# EAGLE design xmas_ornament_2019 (EAGLE 9.5.2)
Assembly variants: Standard
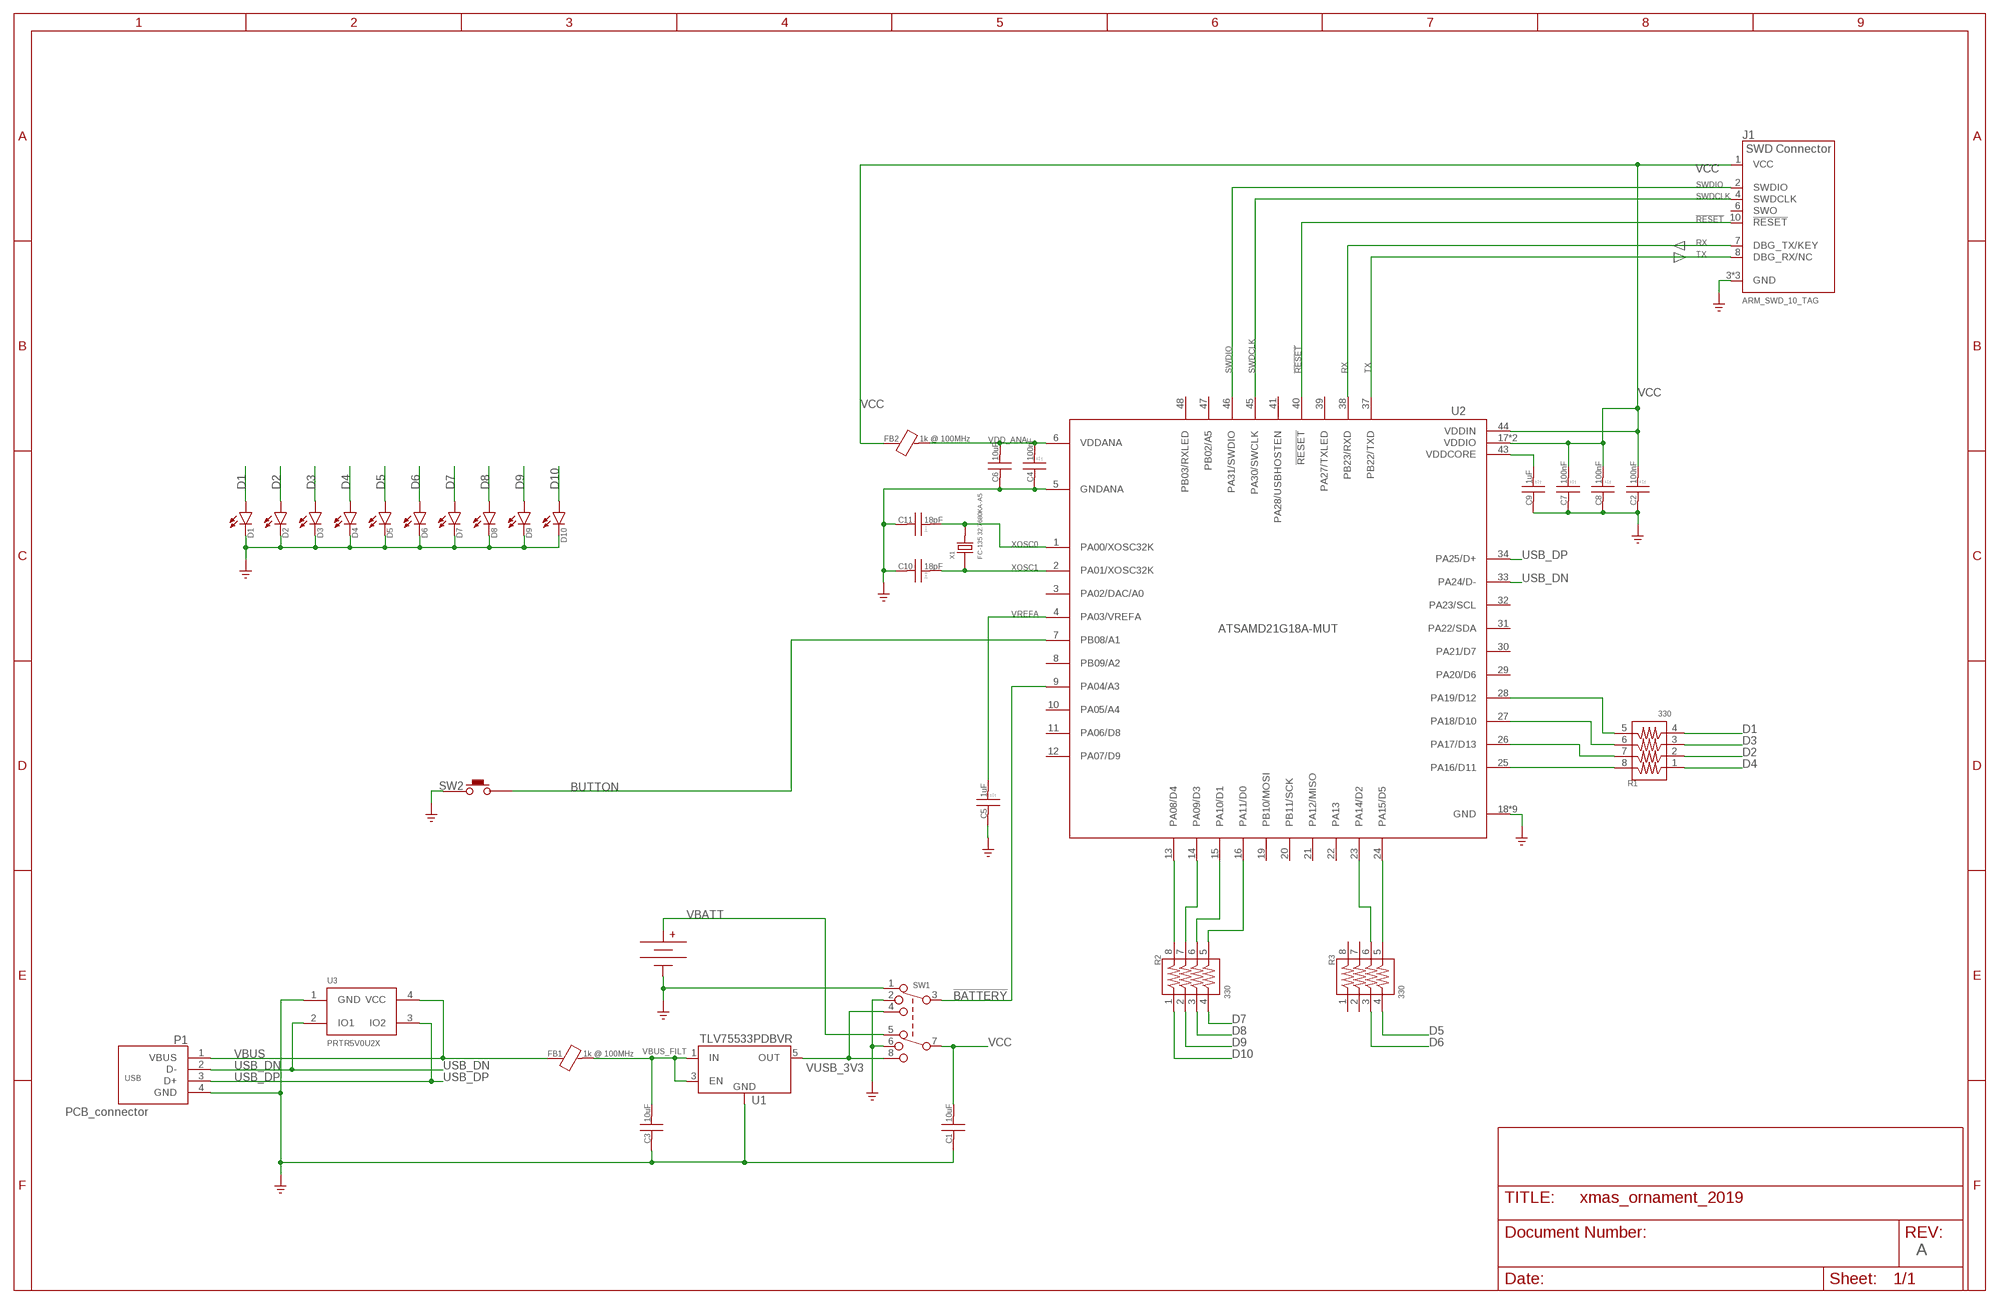
[diagram p0: schematic, sheet 1]

## Parts
C1  10uF  CAP_0805  [0805]
C2  100nF  CAP_0603  [0603]
C3  10uF  CAP_0805  [0805]
C4  100nF  CAP_0603  [0603]
C5  1uF  CAP_0603  [0603]
C6  10uF  CAP_0805  [0805]
C7  100nF  CAP_0603  [0603]
C8  100nF  CAP_0603  [0603]
C9  1uF  CAP_0603  [0603]
C10  18pF  CAP_0603  [0603]
C11  18pF  CAP_0603  [0603]
D1  APT2012LSYCK/J3-PRV  LED0805_BREV  [LED_0805_BREV]
D2  APT2012LSYCK/J3-PRV  LED0805_BREV  [LED_0805_BREV]
D3  APT2012LSYCK/J3-PRV  LED0805_BREV  [LED_0805_BREV]
D4  APT2012LSYCK/J3-PRV  LED0805_BREV  [LED_0805_BREV]
D5  APT2012LSYCK/J3-PRV  LED0805_BREV  [LED_0805_BREV]
D6  APT2012LSYCK/J3-PRV  LED0805_BREV  [LED_0805_BREV]
D7  APT2012LSYCK/J3-PRV  LED0805_BREV  [LED_0805_BREV]
D8  APT2012LSYCK/J3-PRV  LED0805_BREV  [LED_0805_BREV]
D9  APT2012LSYCK/J3-PRV  LED0805_BREV  [LED_0805_BREV]
D10  APT2012LSYCK/J3-PRV  LED0805_BREV  [LED_0805_BREV]
FB1  1k @ 100MHz  FERRITE_BEAD_0603  [0603]
FB2  1k @ 100MHz  FERRITE_BEAD_0603  [0603]
J1  ARM_SWD_10_TAG  [TC2050-IDC-NL]
J2  BU2450-SM-JJ-GTR  BATTERY_BU2450SM-JJ-G  [BU2450SM-JJ-GTR]
P1  PCB_connector  USB-4-PCB-A  [USB-A_PCB]
R1  330  RESISTOR_4_1206  [1206X4]
R2  330  RESISTOR_4_1206  [1206X4]
R3  330  RESISTOR_4_1206  [1206X4]
SW1  JS203011SCQN  SWITCH-DP3T_JS203011SCQN  [JS203011SCQN]
SW2  PTS645SM43SMTR92 LFS  SWITCH-SPST-NO  [SWITCH_6MM]
U1  TLV75533PDBVR  VREG_FIXED+_ENTPS70960DBV  [SOT23-5]
U2  ATSAMD21G18A-MUT  SAMD21G18A-MUT  [QFN-48_GND]
U3  PRTR5V0U2X  [SOT143B]
X1  FC-135 32.7680KA-A5  XTAL-2_3.2X1.5  [XTAL_3.2X1.5]

## Nets
!BATTERY: SW1.3(A_COM) U2.9(PA04/A3)
!RESET: J1.10(!RESET) U2.40(!RESET)
BUTTON: SW2.1 SW2.2 U2.7(PB08/A1)
D1: D1.A R1.4(4A)
D2: D2.A R1.2(2A)
D3: D3.A R1.3(3A)
D4: D4.A R1.1(1A)
D5: D5.A R3.4(4A)
D6: D6.A R3.3(3A)
D7: D7.A R2.4(4A)
D8: D8.A R2.3(3A)
D9: D9.A R2.2(2A)
D10: D10.A R2.1(1A)
GND: C1.1 C2.1 C3.1 C4.1 C5.1 C6.1 C7.1 C8.1 C9.1 C10.1 C11.1 D1.C D2.C D3.C D4.C D5.C D6.C D7.C D8.C D9.C D10.C J1.3(GND) J1.5(GND) J1.9(GND) J2.- P1.4(GND) SW1.1(A1) SW1.2(A2) SW1.6(B2) SW2.3 SW2.4 U1.2(GND) U2.5(GNDANA) U2.18(GND) U2.35(GND) U2.42(GND) U2.GND U2.GND@A1(GND) U2.GND@A2(GND) U2.GND@A3(GND) U2.GND@A4(GND) U2.GND@A(GND) U3.1(GND) ; supply symbol labelled GND_EARTH
N$1: R2.8(1B) U2.13(PA08/D4)
N$2: R2.7(2B) U2.14(PA09/D3)
N$3: R2.6(3B) U2.15(PA10/D1)
N$4: C9.2 U2.43(VDDCORE)
N$5: R2.5(4B) U2.16(PA11/D0)
N$6: R1.8(1B) U2.25(PA16/D11)
N$7: R1.7(2B) U2.26(PA17/D13)
N$8: R1.5(4B) U2.28(PA19/D12)
N$9: R1.6(3B) U2.27(PA18/D10)
N$10: R3.5(4B) U2.24(PA15/D5)
N$11: R3.6(3B) U2.23(PA14/D2)
RX: J1.7(DBG_TX/KEY) U2.38(PB23/RXD)
SWDCLK: J1.4(SWDCLK) U2.45(PA30/SWCLK)
SWDIO: J1.2(SWDIO) U2.46(PA31/SWDIO)
TX: J1.8(DBG_RX/NC) U2.37(PB22/TXD)
USB_DN: P1.2(D-) U2.33(PA24/D-) U3.2(IO1)
USB_DP: P1.3(D+) U2.34(PA25/D+) U3.3(IO2)
VBATT: J2.+ SW1.5(B1)
VBUS: FB1.1 P1.1(VBUS) U3.4(VCC)
VBUS_FILT: C3.2 FB1.2 U1.1(IN) U1.3(EN)
VCC: C1.2 C2.2 C7.2 C8.2 FB2.1 J1.1(VCC) SW1.7(B_COM) U2.17(VDDIO) U2.36(VDDIO) U2.44(VDDIN)
VDD_ANA: C4.2 C6.2 FB2.2 U2.6(VDDANA)
VREFA: C5.2 U2.4(PA03/VREFA)
VUSB_3V3: SW1.4(A3) SW1.8(B3) U1.5(OUT)
XOSC0: C11.2 U2.1(PA00/XOSC32K) X1.2
XOSC1: C10.2 U2.2(PA01/XOSC32K) X1.1
Unconnected: J1.6(SWO) R3.1(1A) R3.2(2A) R3.7(2B) R3.8(1B) U2.3(PA02/DAC/A0) U2.8(PB09/A2) U2.10(PA05/A4) U2.11(PA06/D8) U2.12(PA07/D9) U2.19(PB10/MOSI) U2.20(PB11/SCK) U2.21(PA12/MISO) U2.22(PA13) U2.29(PA20/D6) U2.30(PA21/D7) U2.31(PA22/SDA) U2.32(PA23/SCL) U2.39(PA27/TXLED) U2.41(PA28/USBHOSTEN) U2.47(PB02/A5) U2.48(PB03/RXLED)

## Notes on the sheet
- A

## Library data of the parts
C1 C3 C6 = jetperch:CAP; DIELECTRIC: X7R; MPN: JMK212AB7106KGHT; POPULATE: 1; TOLERANCE: 20%; VOLTAGE: 6.3V
C2 C4 C7 C8 = jetperch:CAP; DIELECTRIC: X5R; MPN: CC0603KRX7R9BB104; POPULATE: 1; TOLERANCE: 20%; VOLTAGE: 50V
C5 C9 = jetperch:CAP; DIELECTRIC: X5R; MPN: CC0603KRX5R6BB105; POPULATE: 1; TOLERANCE: 20%; VOLTAGE: 10V
C10 C11 = jetperch:CAP; DIELECTRIC: C0G; MPN: GRM1885C1H220JA01D; POPULATE: 1; TOLERANCE: 5%; VOLTAGE: 50V
D1-D10 = jetperch:LED: LED Standard single-element LEDs. LED_2SMD_RA suitable for Lite-on LTW-006DCG-E2 LED_2.1x0.6_RA suitable for Kingbright APA2107LZGCK LED_2SMD_REV suitable for Kingbright AM2520ZGCK09 LED_2SMD_REV2 suitable for LP P47F-P2S1-35; MPN: APT2012LSYCK/J3-PRV; POPULATE: 1
FB1 FB2 = jetperch:FERRITE_BEAD; MPN: 742792663; POPULATE: 1
J1 = jetperch:ARM_SWD_10; POPULATE: 0
J2 = jetperch:BATTERY; MPN: BU2450-SM-JJ-GTR; POPULATE: 1
P1 = jetperch:USB-4-PCB: USB 2 Type A 4-pin PCB plug This "connector" uses the PCB without any real connector. WARNING: Although this usually works, it violates the USB specification. It does not correctly attach the shield, and likely will not meet EMI/EMC requirements. Using this connector for high-speed is unwise (just use for full-speed). Real products should not use this!; POPULATE: 0
R1-R3 = jetperch:RESISTOR_4: For panasonic EXB-V8V series resistors; MPN: EXB-38V331JV; POPULATE: 1; TEMP_CO: 200 ppm/°C; TOLERANCE: 5%; WATTAGE: 0.062W
SW1 = jetperch:SWITCH-DP3T; MPN: JS203011SCQN; POPULATE: 1
SW2 = jetperch:SWITCH-SPST-NO; MPN: PTS645SM43SMTR92 LFS; POPULATE: 1
U1 = jetperch:VREG_FIXED+_EN: Positive fixed voltage regulators with enable.; MPN: TLV75533PDBVR; POPULATE: 1
U2 = jetperch:SAMD21G18A-MUT; POPULATE: 1
U3 = jetperch:PRTR5V0U2X: Nexperia (NXP) PRTR5V0U2X TVS suitable for high-speed USB protection.; MPN: PRTR5V0U2X,215; POPULATE: 1
X1 = jetperch:XTAL-2; POPULATE: 1

## Board
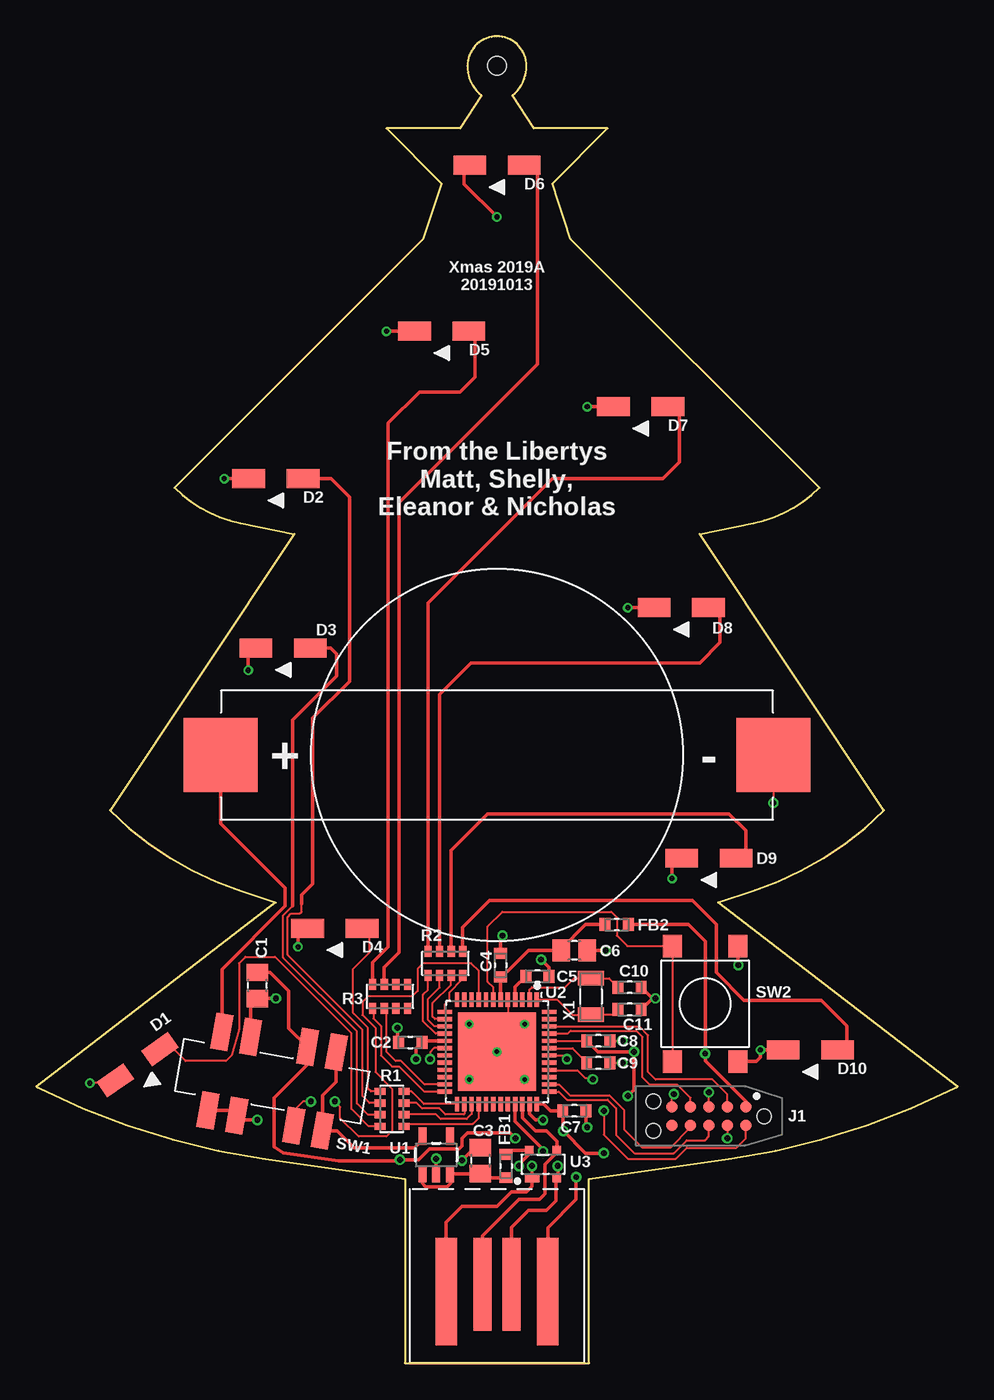
[diagram p1: board, top side]
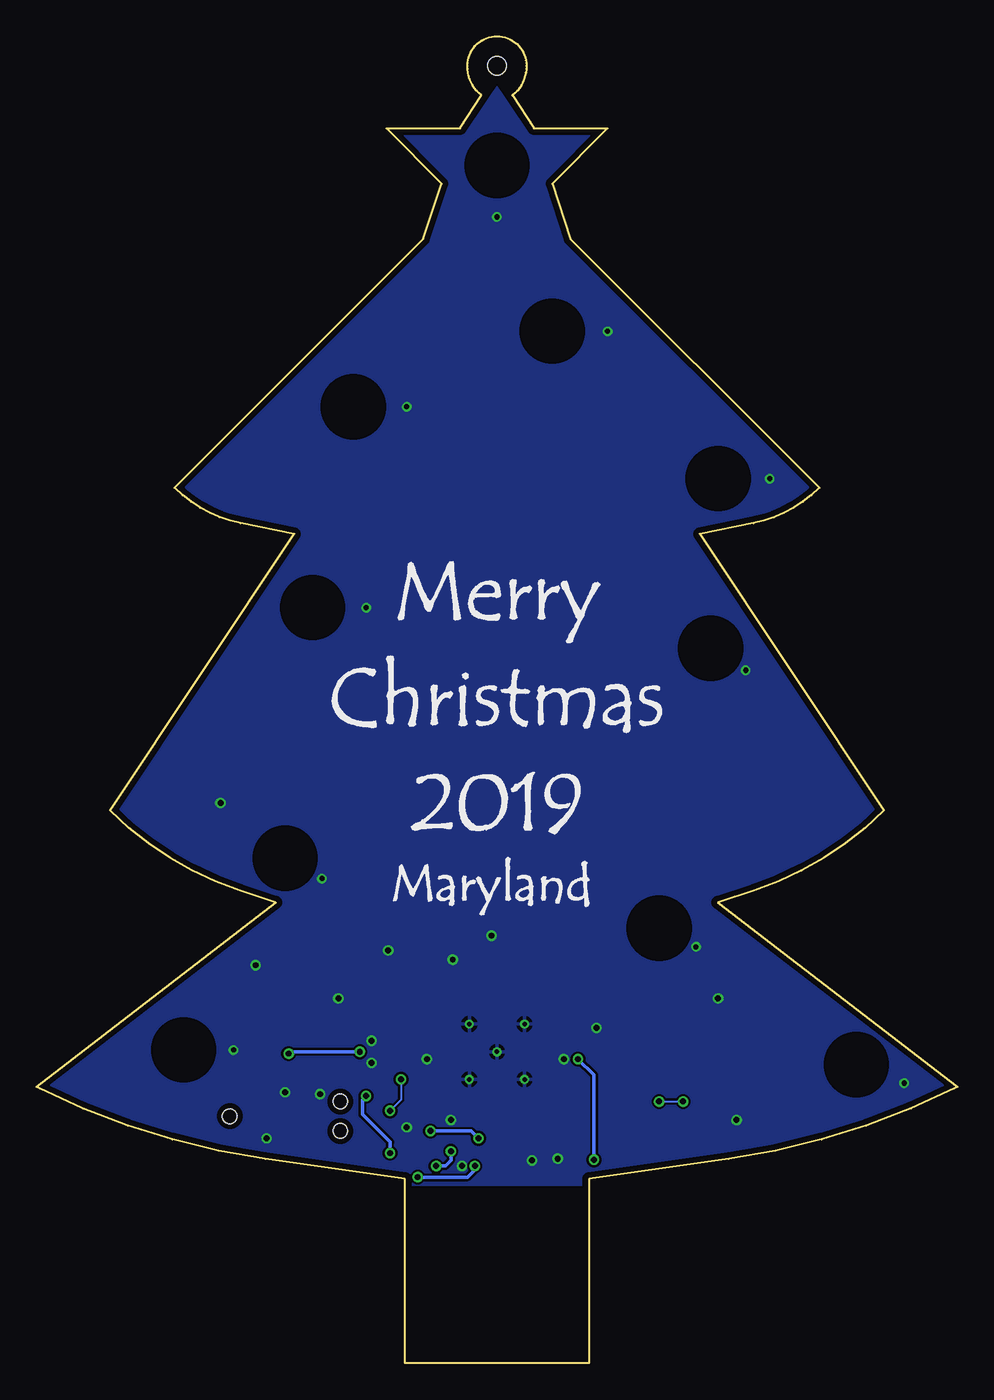
[diagram p2: board, bottom side, seen from below]

Size 63.5 x 91.44 mm. Coordinates in mm from the lower left corner, seen from the top.
Outline: 0,19.05 0.25,18.93 arc18 15.78,14.07 25.4,12.7 25.4,0 38.1,0 38.1,12.7 47.72,14.07 arc18 63.25,18.93 63.5,19.05 46.99,31.75 49.5,32.59 arc27 58.42,38.1 45.72,57.15 49.43,57.89 arc34 53.98,60.33 36.83,77.47 35.56,81.28 39.37,85.09 34.29,85.09 32.82,87.38 arc53 33.78,89.41 arc90 31.75,91.44 arc90 29.72,89.41 arc53 30.68,87.38 29.21,85.09 24.13,85.09 27.94,81.28 26.67,77.47 9.53,60.33 arc34 14.07,57.89 17.78,57.15 5.08,38.1 arc27 14,32.59 16.51,31.75 0,19.05
Copper layers (1*16): Top 0.035mm / dielectric 62mil / Bottom 0.035mm
Design rules "jetperch_2layer_oshpark *": minimum track width 6mil, minimum drill 12mil, track to track 6mil, track to pad 6mil, pad to pad 6mil, via to via 6mil, smd to smd 0mil, copper to edge 15mil, drill to drill 15mil, minimum pad ring 6mil, minimum via ring 6mil, stop-mask expansion 2mil, vias tented up to drill 17mil, thermal gap 10mil
Holes 1.27 mm at 31.75,89.41
bRestrict: area 29.2,85.1 to 34.3,89.7; area 25.4,0 to 38.1,12.2

### Footprints (pad centres in the part's own frame; a part is rotated, then mirrored left to right if it is on the bottom)
0805 = smd 1.198 x 1.5: 1 -0.899,0; 2 0.899,0
0603 = smd 0.75 x 0.9: 1 -0.8,0; 2 0.8,0
LED_0805_BREV = smd 2.25 x 1.3: A 1.875,0; C -1.875,0
TC2050-IDC-NL = smd 0.787 x 0.787: 1 -2.54,-0.635; 2 -1.27,-0.635; 3 0,-0.635; 4 1.27,-0.635; 5 2.54,-0.635; 6 2.54,0.635; 7 1.27,0.635; 8 0,0.635; 9 -1.27,0.635; 10 -2.54,0.635 | hole 0.991: -3.81,0; 3.81,1.016; 3.81,-1.016
BU2450SM-JJ-GTR = smd 5.08 x 5.08: + 19.05,0; - -19.05,0
USB-A_PCB = smd 1.5 x 7.41: 1 -3.5,1.055; 4 3.5,1.055 | smd 1.25 x 6.41: 2 -1,0.555; 3 1,0.555
1206X4 = smd 0.5 x 0.75: 1 -1.2,-0.825; 2 -0.4,-0.825; 3 0.4,-0.825; 4 1.2,-0.825; 5 1.2,0.825; 6 0.4,0.825; 7 -0.4,0.825; 8 -1.2,0.825
JS203011SCQN = smd 1.194 x 2.502: 1 -4,-2.75; 2 -1.994,-2.75; 3 1.994,-2.75; 4 4,-2.75; 5 -4,2.75; 6 -1.994,2.75; 7 1.994,2.75; 8 4,2.75
SWITCH_6MM = smd 1.55 x 1.3: 1 -3.975,2.25; 2 3.975,2.25; 3 -3.975,-2.25; 4 3.975,-2.25
SOT23-5 = smd 0.55 x 1.2: 1 -0.95,-1.3; 2 0,-1.3; 3 0.95,-1.3; 4 0.95,1.3; 5 -0.95,1.3
QFN-48_GND = smd 1 x 0.3: 1 -3.6,2.75; 2 -3.6,2.25; 3 -3.6,1.75; 4 -3.6,1.25; 5 -3.6,0.75; 6 -3.6,0.25; 7 -3.6,-0.25; 8 -3.6,-0.75; 9 -3.6,-1.25; 10 -3.6,-1.75; 11 -3.6,-2.25; 12 -3.6,-2.75; 25 3.6,-2.75; 26 3.6,-2.25; 27 3.6,-1.75; 28 3.6,-1.25; 29 3.6,-0.75; 30 3.6,-0.25; 31 3.6,0.25; 32 3.6,0.75; 33 3.6,1.25; 34 3.6,1.75; 35 3.6,2.25; 36 3.6,2.75 | smd 0.3 x 1: 13 -2.75,-3.6; 14 -2.25,-3.6; 15 -1.75,-3.6; 16 -1.25,-3.6; 17 -0.75,-3.6; 18 -0.25,-3.6; 19 0.25,-3.6; 20 0.75,-3.6; 21 1.25,-3.6; 22 1.75,-3.6; 23 2.25,-3.6; 24 2.75,-3.6; 37 2.75,3.6; 38 2.25,3.6; 39 1.75,3.6; 40 1.25,3.6; 41 0.75,3.6; 42 0.25,3.6; 43 -0.25,3.6; 44 -0.75,3.6; 45 -1.25,3.6; 46 -1.75,3.6; 47 -2.25,3.6; 48 -2.75,3.6 | smd 5.4 x 5.4: GND 0,0 | drill 0.305: GND@A 0,0; GND@A1 -1.905,1.905; GND@A2 1.905,1.905; GND@A3 1.905,-1.905; GND@A4 -1.905,-1.905
SOT143B = smd 1 x 0.6: 1 -0.75,-0.95 | smd 0.6 x 0.6: 2 0.95,-0.95; 3 0.95,0.95; 4 -0.95,0.95
XTAL_3.2X1.5 = smd 1 x 1.8: 1 -1.25,0; 2 1.25,0

### Placement (x,y rotation side)
C1  15.24,26.04 90 top
C2  25.78,22.1 0 top
C3  30.61,13.97 270 top
C4  32,27.43 270 top
C5  34.54,26.67 180 top
C6  37.08,28.45 180 top
C7  37.08,17.4 180 top
C8  38.73,22.23 180 top
C9  38.73,20.7 180 top
C10  40.89,25.91 180 top
C11  40.89,24.38 180 top
D1  6.99,20.57 35 top
D2  16.51,60.96 0 top
D3  17.02,49.28 0 top
D4  20.57,29.97 0 top
D5  27.94,71.12 0 top
D6  31.75,82.55 0 top
D7  41.66,65.91 0 top
D8  44.45,52.07 0 top
D9  46.35,34.8 0 top
D10  53.34,21.59 0 top
FB1  32.38,13.59 270 top
FB2  40.01,30.23 180 top
J1  46.35,17.02 180 top
J2  31.75,41.91 180 top
P1  31.75,6 180 top
R1  24.51,17.53 270 top
R2  28.19,27.56 180 top
R3  24.38,25.27 180 top
SW1  16.26,19.43 350 top
SW2  46.1,24.77 90 top
U1  27.56,14.35 0 top
U2  31.75,21.46 270 top
U3  34.92,13.72 0 top
X1  38.23,25.27 270 top

### Tracks (layer width: path | path; a pad name or v marks a point on that pad's centre or on a via)
!BATTERY  (via drill 0.41)
  Top 0.152: U2.9 30.5,27.03 29.97,27.56 26.67,27.56 26.29,27.18 26.29,25.65 25.91,25.27 22.86,25.27 22.48,24.89 22.48,24 23.37,23.11 23.37,20.07 24.51,18.92 24.51,16 24.13,15.62 22.23,15.62 20.95,16.89 20.95,17.65 v20.57,18.03 | SW1.3 17.74,17.39 18.38,18.03 v18.92,18.03
  Bottom 0.152: v20.57,18.03 v18.92,18.03
!RESET  (via drill 0.41)
  Top 0.152: U2.40 35.37,20.19 37.3,20.19 37.84,19.64 38.27,19.64 v38.35,19.56 | v39.12,17.4 39.12,15.75 40.77,14.1 44.07,14.1 44.83,14.86 48.26,14.86 48.9,15.49 J1.10
  Bottom 0.152: v39.12,17.4 38.35,18.16 v38.35,19.56
BUTTON
  Top 0.152: U2.7 31.5,25.9 31.11,26.29 31.11,30.1 32.13,31.11 39.62,31.11 40.01,30.73 40.01,29.46 40.73,28.74 SW2.2 SW2.1
D1
  Top 0.152: R1.4 22.92,16.33 21.72,17.53 21.72,22.73 16.45,28 14.41,28 13.97,27.56 13.97,23 13.46,21.21 13.08,20.83 10.29,20.83 9.4,21.72 8.59,21.72 D1.A
D2
  Top 0.152: R1.2 22.97,17.93 22.48,18.41 22.48,22.99 17.32,28.14 17.32,30.73 17.58,30.99 18.16,30.99 18.29,31.11 18.29,31.66
  Top 0.254: D2.A 20.32,60.96 21.59,59.69 21.59,46.99 19.05,44.45 19.05,33.02 18.29,32.26 18.29,31.66
D3
  Top 0.152: R1.3 22.88,17.13 22.1,17.91 22.1,22.86 17.02,27.94 17.02,30.86 17.65,31.5
  Top 0.254: 17.65,31.5 17.65,44.32 20.7,47.37 20.7,48.87 20.29,49.28 D3.A
D4
  Top 0.152: R1.1 23.06,18.73 22.86,18.92 22.86,23.11 21.84,24.13 21.84,27.18 22.99,28.32 22.99,29.43 D4.A
D5
  Top 0.254: R3.4 23.18,27.63 24.26,28.7 24.26,64.77 26.42,66.93 29.21,66.93 30.23,67.94 30.23,70.71 D5.A
D6
  Top 0.254: R3.3 23.98,27.29 25.02,28.32 25.02,59.31 34.54,68.83 34.54,82.14 34.13,82.55 D6.A
D7
  Top 0.254: R2.4 26.99,52.39 35.56,60.96 43.18,60.96 44.32,62.1 44.32,65.41 43.81,65.91 D7.A
D8
  Top 0.254: R2.3 27.79,46.08 29.97,48.26 45.72,48.26 47.12,49.66 47.12,51.82 46.86,52.07 D8.A
D9
  Top 0.254: R2.2 28.59,35.33 31.11,37.85 47.75,37.85 48.9,36.7 48.9,35.31 48.39,34.8 D9.A
D10
  Top 0.254: D10.A 55.47,21.84 55.88,21.84 55.88,23.24 54.1,25.02 48.77,25.02 46.86,26.92 46.86,30.23 45.21,31.88 31.24,31.88 29.39,30.03 R2.1
GND  (via drill 0.35, 0.41)
  Top 0.152: J1.3 v46.35,18.67 | J1.9 v47.62,15.49 | J1.5 43.81,18.41 v43.94,18.54 | C8.1 v40.39,22.23 | C9.1 v40.39,20.7 | U2.42 36.32,21.21 v36.58,20.95 | J2.- v50.8,38.61 | U2.5 32.5,22.21 U2.GND@A | U2.18 27.43,21.72 27.14,21.43 v27.14,20.95 | D1.C 5.25,19.3 v3.68,19.3
  Top 0.254: P1.4 28.25,9.71 29.34,10.79 31.75,10.79 32.77,11.81 33.78,11.81 34.17,12.2 U3.1 34.17,13.58 v34.16,13.59 | U1.2 v27.56,14.1 | C3.1 30.24,14.87 v29.34,13.97 | U2.35 34,17.18 34.42,16.76 v34.92,16.76 | C11.1 42.46,25.15 | C10.1 42.46,25.15 | 42.46,25.15 v42.67,25.15 | C6.1 v39.24,28.45 | C5.1 35.34,27.27 v34.8,27.81 | v32.13,29.46 32,29.34 C4.1 | v16.51,25.15 16.5,25.14 C1.1 14.77,24.67 SW1.6 | C2.1 24.89,22.19 v24.89,23.11 | SW1.1 13.47,17.42 SW1.2 14.12,16.76 v15.24,16.76 | SW2.4 48.35,27.47 v48.39,27.43 | SW2.3 49.62,20.79 49.91,21.08 v49.91,21.59 D10.C | C7.1 37.88,16.34 v37.97,16.26 | D4.C 18.32,29.97 18.03,29.69 v18.03,28.7 | D3.C 14.61,48.74 v14.61,47.75 | D2.C v12.95,60.96 | D5.C v24.13,71.12 | D6.C 29.49,82.17 29.49,81.25 v31.75,78.99 | D7.C v37.97,65.91 | D8.C v40.77,52.07 | D9.C 44.23,34.8 43.81,34.39 v43.81,33.4
  pour Bottom: 0,0 0,88.9 63.5,88.9 63.5,0
N$1
  Top 0.152: R2.8 29.39,26.47 28.45,25.53 28.45,25.02 28.15,24.72 U2.13
N$2
  Top 0.152: R2.7 28.57,26.71 28.57,26.09 27.3,24.82 27.3,23.88 27.47,23.71 U2.14
N$3
  Top 0.152: U2.15 27.46,23.21 27,23.67 27,25.09 27.79,25.89 R2.6
N$4
  Top 0.152: U2.43 36.96,21.71 37.94,20.74 C9.2
N$5
  Top 0.152: U2.16 27.53,22.71 26.67,23.57 26.67,25.4 26.99,25.72 R2.5
N$6
  Top 0.152: U2.25 26.71,17.86 25.85,18.73 R1.8
N$7
  Top 0.152: U2.26 29.5,17.18 29.45,17.13 28.2,17.13 27.78,17.56 26.59,17.56 26.22,17.93 R1.7
N$8
  Top 0.152: R1.5 25.52,16.51 30.1,16.51 30.5,16.91 U2.28
N$9
  Top 0.152: U2.27 30,17.17 29.66,16.83 27.87,16.83 27.56,17.14 25.36,17.14 R1.6
N$10
  Top 0.152: U2.24 26.75,18.71 25.02,20.45 24.51,20.45 23.75,21.21 23.75,23.24 23.24,23.75 23.24,24.39 R3.5
N$11
  Top 0.152: U2.23 26.76,19.21 25.15,20.83 24.77,20.83 24.11,21.48 24.11,24.32 R3.6
RX
  Top 0.152: J1.7 45.09,16.26 43.69,14.86 41.78,14.86 40.51,16.13 40.51,17.45 39.5,18.47 36.78,18.47 36.03,19.21 U2.38
SWDCLK
  Top 0.152: U2.45 36.64,22.71 36.83,22.9 41.36,22.9 41.78,22.48 41.78,19.68 42.29,19.18 44.2,19.18 45.09,18.29 J1.4
SWDIO
  Top 0.152: U2.46 41.56,23.21 42.16,22.61 42.16,20.07 42.67,19.56 46.61,19.56 47.62,18.54 J1.2
TX
  Top 0.152: J1.8 46.35,15.62 46.1,15.37 44.83,15.37 43.94,14.48 41.23,14.48 39.95,15.75 39.95,17.58 39.37,18.16 36.58,18.16 36.02,18.71 U2.37
USB_DN  (via drill 0.41)
  Top 0.254: P1.2 32.75,9.38 33.91,10.54 35.18,10.54 35.81,11.18 35.81,12.71 U3.2 35.94,12.83 v35.94,13.59 | U2.33 33,16.66 34.92,14.73 v34.92,14.61
  Bottom 0.254: v34.92,14.61 34.92,13.97 35.31,13.59 v35.94,13.59
USB_DP
  Top 0.254: P1.3 30.75,8.78 33.27,11.3 34.67,11.3 35.05,11.68 35.05,13.72 35.88,14.54 U3.3 35.88,15.31 35.18,16 34.42,16 33.5,16.92 U2.34
VBATT
  Top 0.254: J2.+ 12.7,37.21 17.14,32.77 17.14,31.5 12.79,27.14 SW1.5
VBUS  (via drill 0.41)
  Top 0.254: FB1.1 32.42,14.35 32.51,14.35 32.83,14.67 U3.4 33.91,14.6 33.91,14.35 33.27,13.72 v33.27,13.59 | P1.1 35.25,9.34 37.21,11.3 v37.21,12.83
  Bottom 0.254: v37.21,12.83 33.78,12.83 33.27,13.34 v33.27,13.59
VBUS_FILT
  Top 0.254: FB1.2 30.89,12.79 C3.2 30.59,13.05 28.57,13.05 | U1.3 28.57,13.05 | U1.1 26.61,12.38 26.82,12.17 28.3,12.17 28.57,12.45 28.57,13.05
VCC  (via drill 0.41)
  Top 0.152: U2.44 37.92,22.21 C8.2
  Top 0.254: U2.17 26.7,22.21 C2.2 26.16,21.68 v26.16,20.95 | U2.36 34.97,17.86 35.43,17.4 C7.2 36.28,16.04 v36.32,16 37.85,14.48 v39.12,14.48 | C1.2 16.12,26.93 17.4,25.65 17.4,23.09 SW1.7 18.7,20.6 16.38,18.29 16.38,14.9 17,14.49 20.85,13.94 24.98,13.94 v25.06,14.02 26.34,14.02 27.09,14.77 29.12,14.77 29.34,14.99 29.34,15.49 29.72,15.88 32.64,15.88 v33.02,15.49 | FB2.1 44.96,30.23 46.1,29.08 v46.1,21.34 46.1,20.83 48.9,18.03 J1.1 | C8.2 38.7,21.46 v41.2,21.46 41.2,18.85 v40.77,18.41
  Bottom 0.254: v41.2,21.46 45.97,21.46 v46.1,21.34 | v25.06,14.02 25.06,19.86 v26.16,20.95 | v39.12,14.48 39.12,15.24 41.02,17.14 41.02,18.16 v40.77,18.41 | v33.02,15.49 33.53,16 v36.32,16
VDD_ANA
  Top 0.254: U2.6 C4.2 32.09,26.63 33.91,28.45 C6.2 36.19,28.57 37.85,30.23 FB2.2
VREFA
  Top 0.254: U2.4 33,25.93 C5.2
VUSB_3V3
  Top 0.254: U1.5 26.61,15.4 26.07,14.86 21.9,14.86 20.73,16.03 SW1.4 19.72,18.45 20.67,19.4 SW1.8
XOSC0
  Top 0.152: U2.1 35.9,25.06 36.96,24 38.21,24 X1.2 39.73,24.02 C11.2
XOSC1
  Top 0.152: U2.2 34,25.75 34.16,25.91 36.45,25.91 37.06,26.52 X1.1 39.48,26.52 C10.2

### Text on the board
tNames: From the Libertys / Matt, Shelly, / Eleanor & Nicholas
_tsilk: Xmas 2019A / 20191013